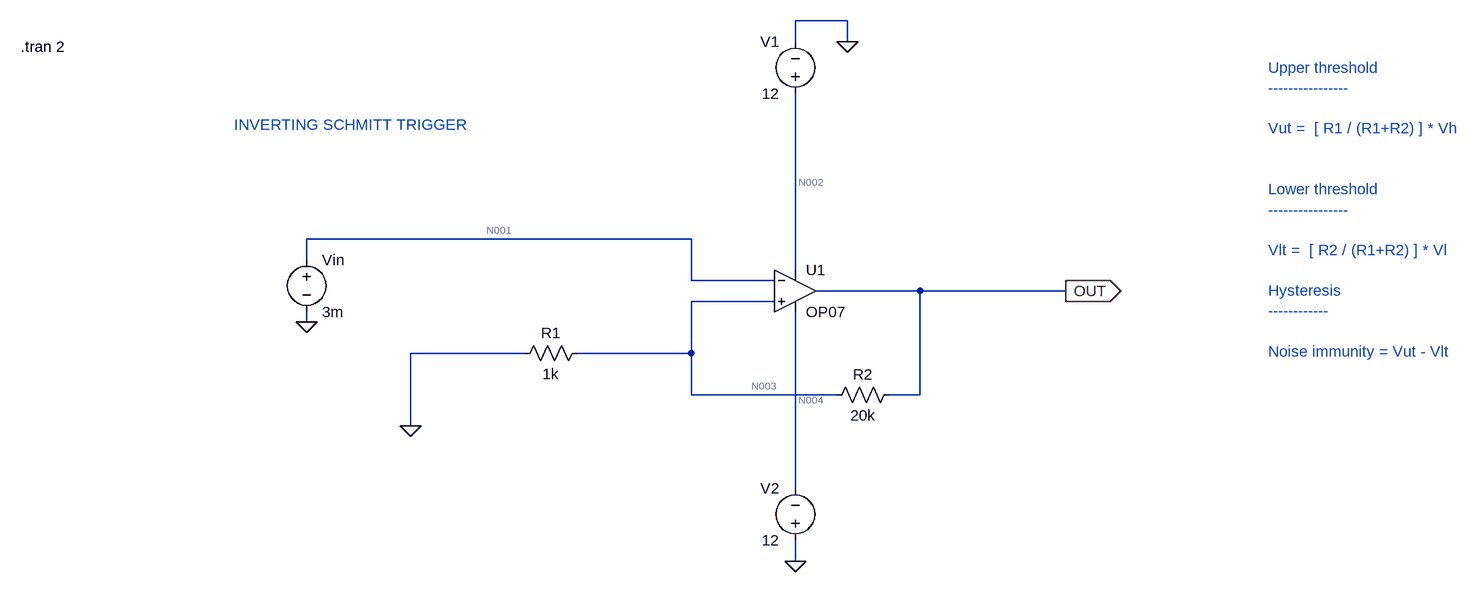
[diagram p0: schematic opAmp_as_inverting_schmitt_trigger.asc]
opAmp_as_inverting_schmitt_trigger.asc, the LTspice schematic file:
Version 4.1
SHEET 1 1320 680
WIRE 336 -240 256 -240
WIRE 256 -208 256 -240
WIRE 336 -208 336 -240
WIRE 96 96 -496 96
WIRE -496 128 -496 96
WIRE 256 144 256 -128
WIRE 96 160 96 96
WIRE 224 160 96 160
WIRE 448 176 288 176
WIRE 672 176 448 176
WIRE 224 192 96 192
WIRE -496 224 -496 208
WIRE -160 272 -336 272
WIRE 96 272 96 192
WIRE 96 272 -80 272
WIRE 96 336 96 272
WIRE 320 336 96 336
WIRE 448 336 448 176
WIRE 448 336 400 336
WIRE -336 384 -336 272
WIRE 256 480 256 208
WIRE 256 592 256 560
FLAG 336 -208 0
FLAG 256 592 0
FLAG -496 224 0
FLAG 672 176 OUT
IOPIN 672 176 Out
FLAG -336 384 0
SYMBOL OpAmps\\OP07 256 112 R0
SYMATTR InstName U1
SYMBOL voltage 256 -112 R180
WINDOW 0 24 96 Left 2
WINDOW 3 24 16 Left 2
WINDOW 123 0 0 Left 0
WINDOW 39 0 0 Left 0
SYMATTR InstName V1
SYMATTR Value 12
SYMBOL voltage 256 576 R180
WINDOW 0 24 96 Left 2
WINDOW 3 24 16 Left 2
WINDOW 123 0 0 Left 0
WINDOW 39 0 0 Left 0
SYMATTR InstName V2
SYMATTR Value 12
SYMBOL voltage -496 112 R0
WINDOW 123 0 0 Left 0
WINDOW 39 0 0 Left 0
SYMATTR InstName Vin
SYMATTR Value 3m
SYMBOL res 416 320 R90
WINDOW 0 0 56 VBottom 2
WINDOW 3 32 56 VTop 2
SYMATTR InstName R2
SYMATTR Value 20k
SYMBOL res -64 256 R90
WINDOW 0 0 56 VBottom 2
WINDOW 3 32 56 VTop 2
SYMATTR InstName R1
SYMATTR Value 1k
TEXT -936 -200 Left 2 !.tran 2
TEXT 984 -168 Left 2 ;Upper threshold\n----------------\n \nVut =  [ R1 / (R1+R2) ] * Vh\n \n \nLower threshold\n----------------\n \nVlt =  [ R2 / (R1+R2) ] * Vl\n \nHysteresis\n------------\n \nNoise immunity = Vut - Vlt
TEXT -608 -80 Left 2 ;INVERTING SCHMITT TRIGGER

The netlist it stands for:
* opAmp_as_inverting_schmitt_trigger.asc
X§U1 N003 N001 N002 N004 OUT LT1001  ; OP07, pins In+ In- V+ V- OUT
V1 N002 0 12
V2 0 N004 12
Vin N001 0 3m
R2 OUT N003 20k
R1 N003 0 1k
.tran 2
* Upper threshold
* ----------------
* Vut =  [ R1 / (R1+R2) ] * Vh
* Lower threshold
* ----------------
* Vlt =  [ R2 / (R1+R2) ] * Vl
* Hysteresis
* ------------
* Noise immunity = Vut - Vlt
* INVERTING SCHMITT TRIGGER
.lib LTC.lib
.backanno
.end

* Results of the author's LTspice run, read from the files saved beside the schematic
* Operating Point, zero values left out:
*   V(n001) = 3 mV
*   V(n004) = -12 V
*   V(out) = 11.05 V
*   V(n003) = 526.3 mV
*   V(n002) = 12 V
*   I(V1) = -2.517 mA
*   I(R2) = 526.3 µA
*   I(V2) = -1.998 mA
*   I(Vin) = 7.064 nA
*   I(R1) = 526.3 µA
*   Ix(u1:1) = 7.065 nA
*   Ix(u1:2) = -7.064 nA
*   Ix(u1:3) = 2.517 mA
*   Ix(u1:4) = -1.998 mA
*   Ix(u1:5) = -526.3 µA